# Altium schematic sheet TopPrinter-F0.2.1_PCB.SchDoc
size 635 x 431 mm
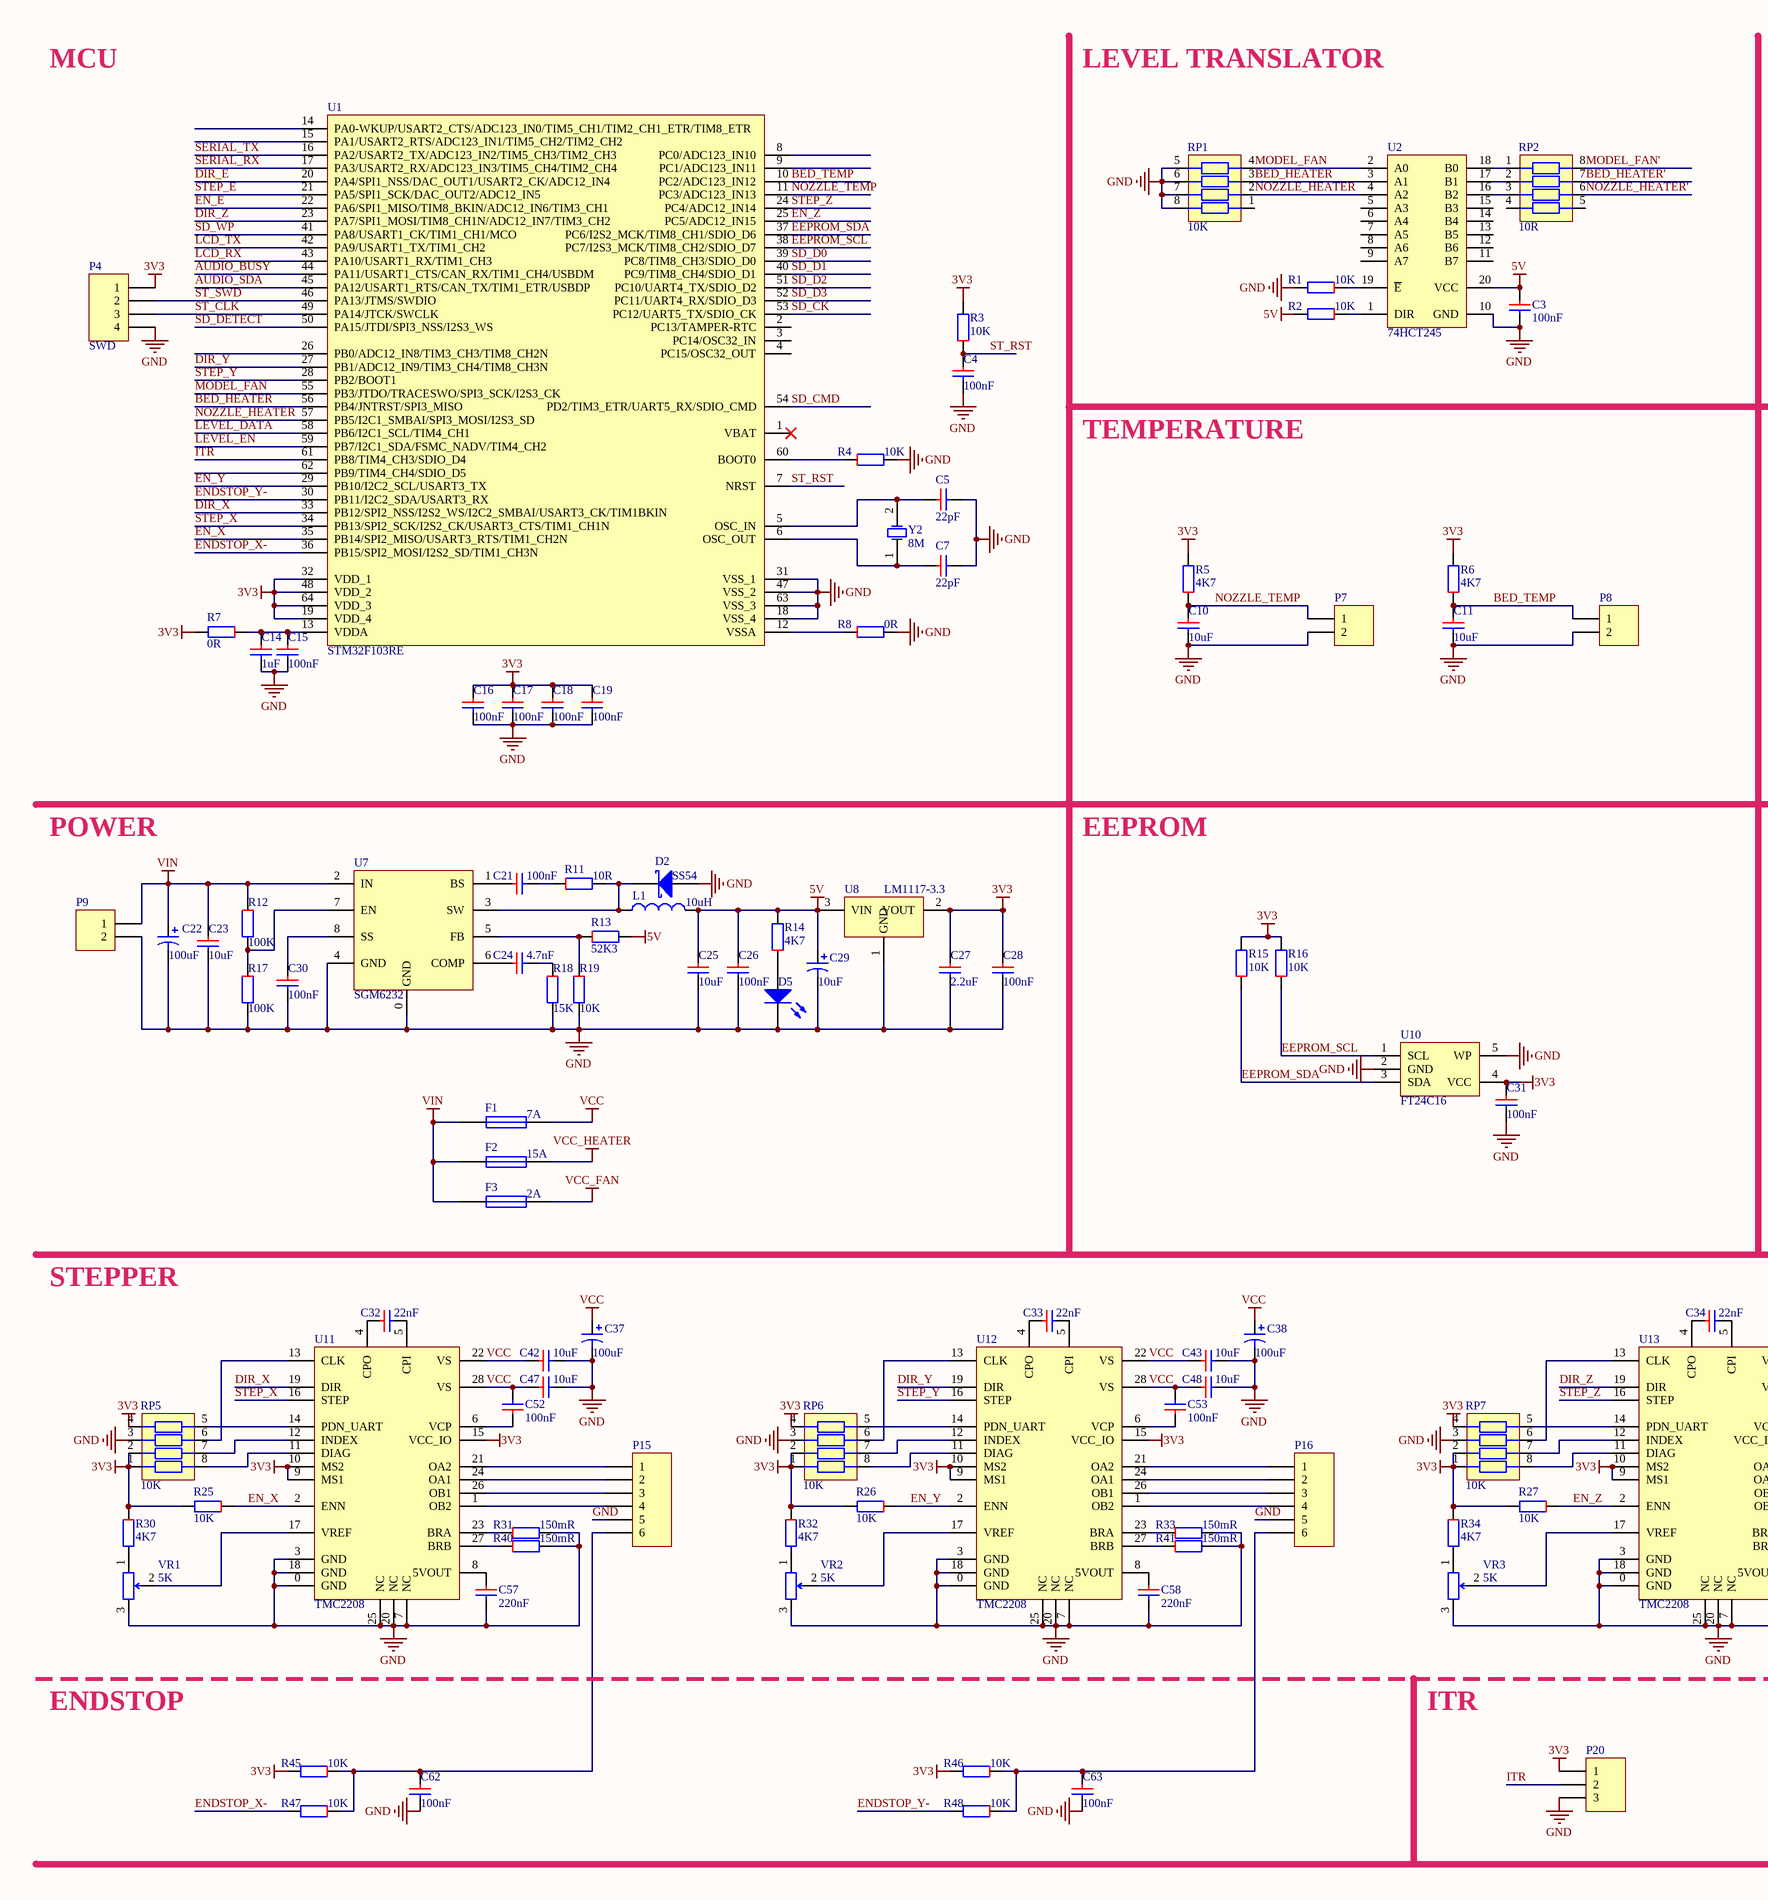
[diagram p0: TopPrinter-F0.2.1_PCB.SchDoc, left]
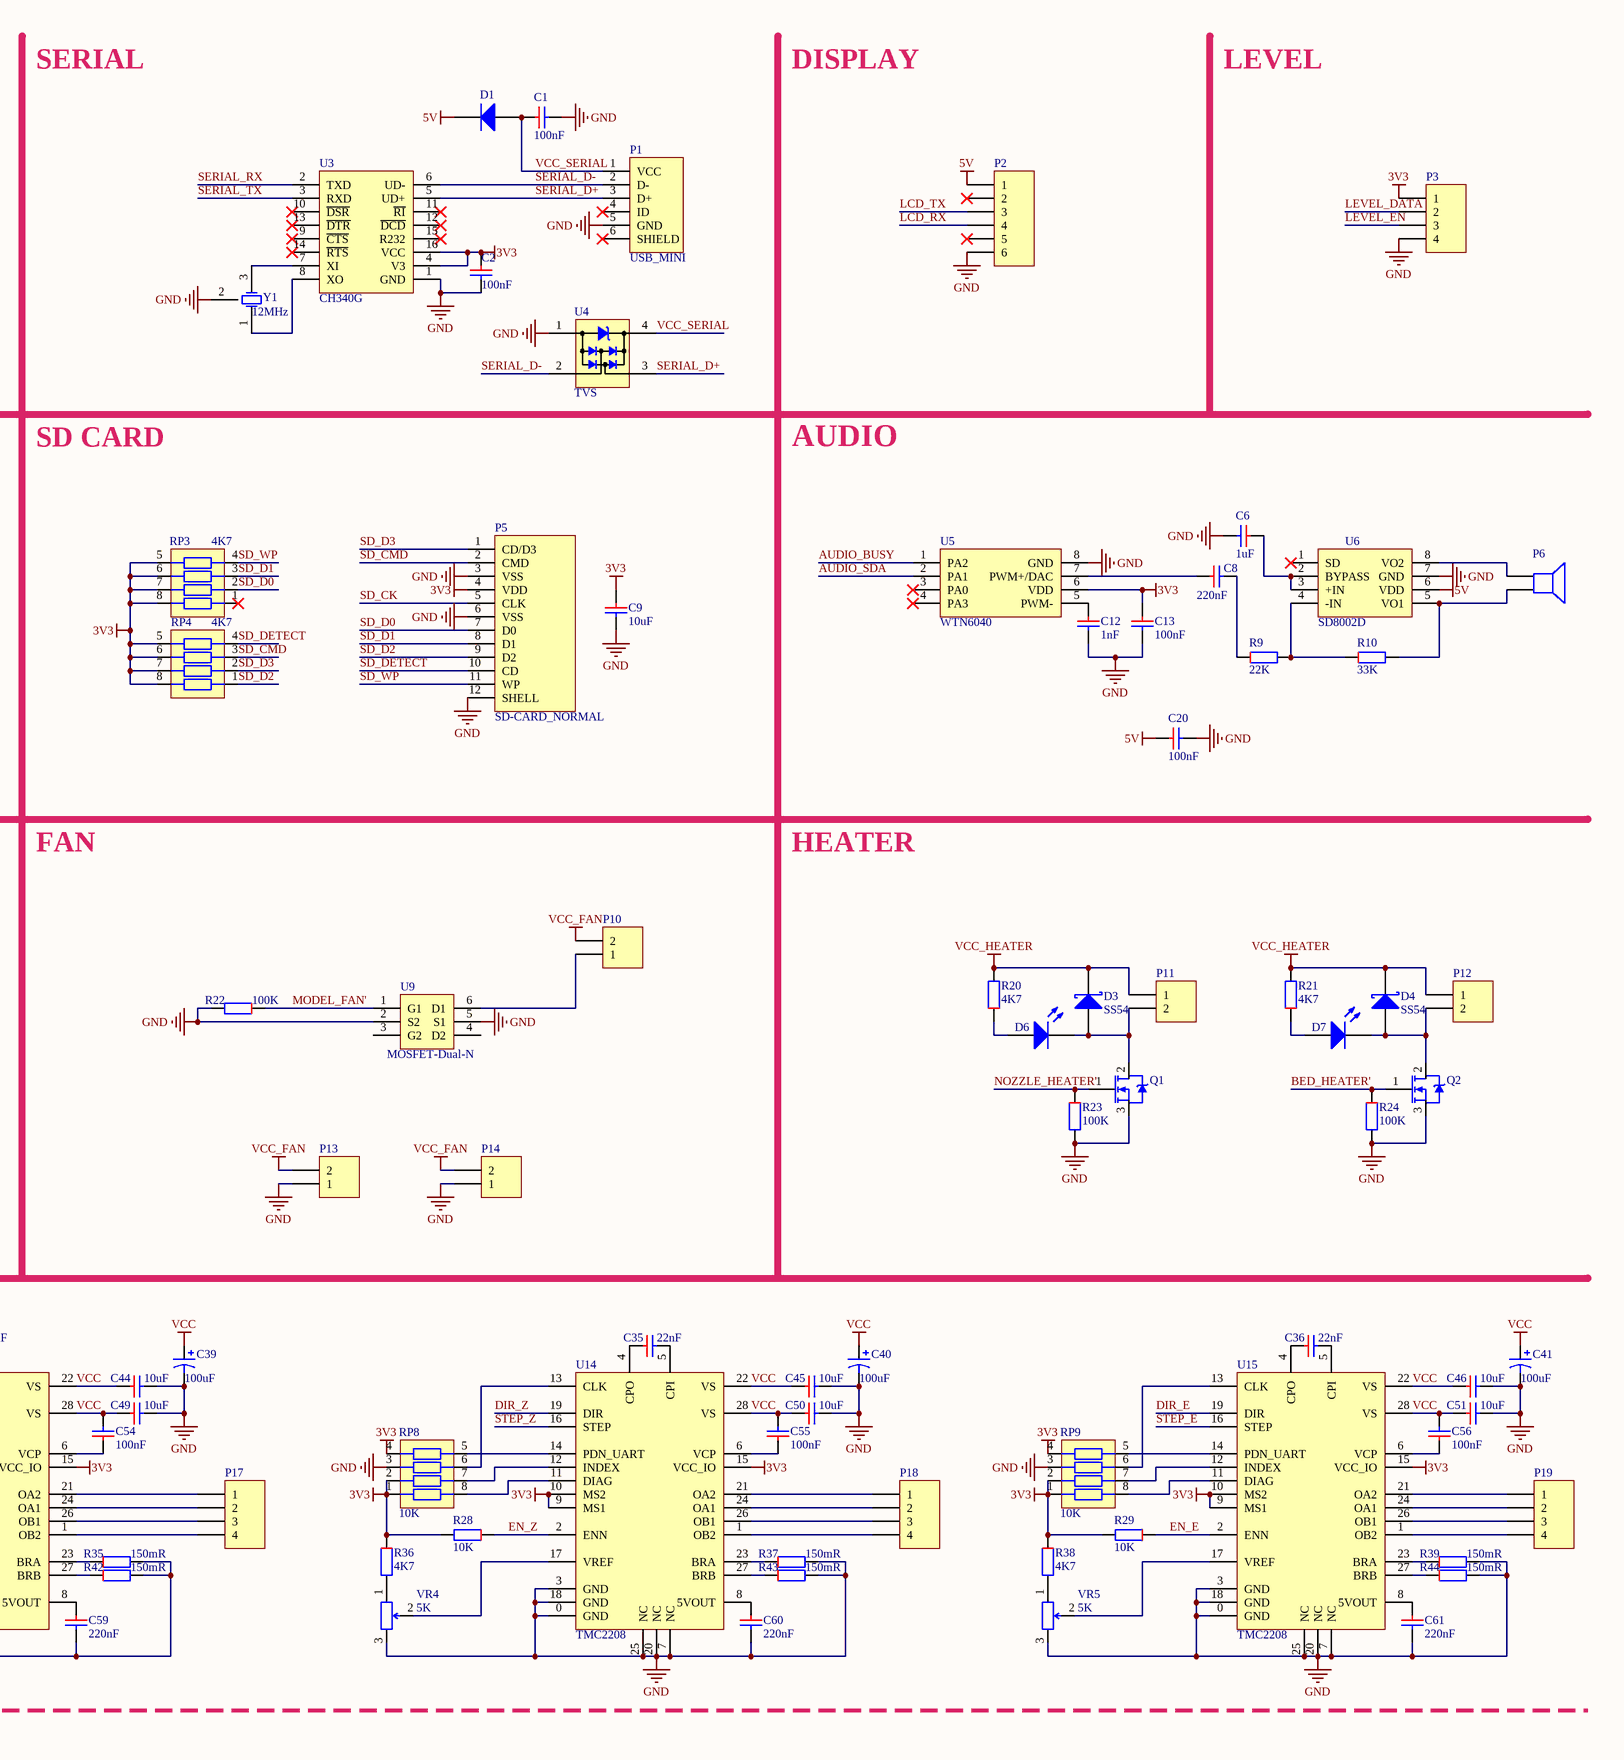
[diagram p1: TopPrinter-F0.2.1_PCB.SchDoc, right]

## Parts
C1  100nF  [C-0603]
C2  100nF  [C-0603]
C3  100nF  [C-0603]
C4  100nF  [C-0603]
C5  22pF  [C-0603]
C6  1uF  [C-0603]
C7  22pF  [C-0603]
C8  220nF  [C-0603]
C9  10uF  [C-0603]
C10  10uF  [C-0603]
C11  10uF  [C-0603]
C12  1nF  [C-0603]
C13  100nF  [C-0603]
C14  1uF  [C-0603]
C15  100nF  [C-0603]
C16  100nF  [C-0603]
C17  100nF  [C-0603]
C18  100nF  [C-0603]
C19  100nF  [C-0603]
C20  100nF  [C-0603]
C21  100nF  [C-0603]
C22  100uF  [CAP-6.3x7.7]
C23  10uF  [C-0805]
C24  4.7nF  [C-0603]
C25  10uF  [C-0805]
C26  100nF  [C-0603]
C27  2.2uF  [C-0603]
C28  100nF  [C-0603]
C29  10uF  [TAN-A]
C30  100nF  [C-0603]
C31  100nF  [C-0603]
C32  22nF  [C-0603]
C33  22nF  [C-0603]
C34  22nF  [C-0603]
C35  22nF  [C-0603]
C36  22nF  [C-0603]
C37  100uF  [CAP-6.3x7.7]
C38  100uF  [CAP-6.3x7.7]
C39  100uF  [CAP-6.3x7.7]
C40  100uF  [CAP-6.3x7.7]
C41  100uF  [CAP-6.3x7.7]
C42  10uF  [C-0805]
C43  10uF  [C-0805]
C44  10uF  [C-0805]
C45  10uF  [C-0805]
C46  10uF  [C-0805]
C47  10uF  [C-0805]
C48  10uF  [C-0805]
C49  10uF  [C-0805]
C50  10uF  [C-0805]
C51  10uF  [C-0805]
C52  100nF  [C-0603]
C53  100nF  [C-0603]
C54  100nF  [C-0603]
C55  100nF  [C-0603]
C56  100nF  [C-0603]
C57  220nF  [C-0603]
C58  220nF  [C-0603]
C59  220nF  [C-0603]
C60  220nF  [C-0603]
C61  220nF  [C-0603]
C62  100nF  [C-0603]
C63  100nF  [C-0603]
D1  MBR0520  [SOD-123]  (value not drawn)
D2  SS54  [DO-214AC]
D3  SS54  [DO-214AC]
D4  SS54  [DO-214AC]
D5  GRE  [LED-0603]  (value not drawn)
D6  BLU  [LED-0603]  (value not drawn)
D7  BLU  [LED-0603]  (value not drawn)
F1  7A  [F-1206]
F2  15A  [F-1206]
F3  2A  [F-1206]
L1  10uH  [L-6045]
P1  USB_MINI  [USB-MINI-5P-SMD]
P2  (no value)  [XH-6A]
P3  (no value)  [XH-4A]
P4  SWD  [HDR1X4]
P5  SD-CARD_NORMAL  [SD-NORMAL-9P-PUSH]
P6  (no value)  [XH-2A]
P7  (no value)  [XH-2A]
P8  (no value)  [XH-2A]
P9  (no value)  [CON-5.0-2P]
P10  (no value)  [XH-2A]
P11  (no value)  [CON-5.0-2P]
P12  (no value)  [CON-5.0-2P]
P13  (no value)  [XH-2A]
P14  (no value)  [XH-2A]
P15  (no value)  [XH-6A]
P16  (no value)  [XH-6A]
P17  (no value)  [XH-4A]
P18  (no value)  [XH-4A]
P19  (no value)  [XH-4A]
P20  Header 3  [XH-3A]  (value not drawn)
Q1  HY3403D  [TO-252-2]  (value not drawn)
Q2  HY3403D  [TO-252-2]  (value not drawn)
R1  10K  [R-0603]
R2  10K  [R-0603]
R3  10K  [R-0603]
R4  10K  [R-0603]
R5  4K7  [R-0603]
R6  4K7  [R-0603]
R7  0R  [R-0603]
R8  0R  [R-0603]
R9  22K  [R-0603]
R10  33K  [R-0603]
R11  10R  [R-0603]
R12  100K  [R-0603]
R13  52K3  [R-0603]
R14  4K7  [R-0603]
R15  10K  [R-0603]
R16  10K  [R-0603]
R17  100K  [R-0603]
R18  15K  [R-0603]
R19  10K  [R-0603]
R20  4K7  [R-0603]
R21  4K7  [R-0603]
R22  100K  [R-0603]
R23  100K  [R-0603]
R24  100K  [R-0603]
R25  10K  [R-0603]
R26  10K  [R-0603]
R27  10K  [R-0603]
R28  10K  [R-0603]
R29  10K  [R-0603]
R30  4K7  [R-0603]
R31  150mR  [R-1206]
R32  4K7  [R-0603]
R33  150mR  [R-1206]
R34  4K7  [R-0603]
R35  150mR  [R-1206]
R36  4K7  [R-0603]
R37  150mR  [R-1206]
R38  4K7  [R-0603]
R39  150mR  [R-1206]
R40  150mR  [R-1206]
R41  150mR  [R-1206]
R42  150mR  [R-1206]
R43  150mR  [R-1206]
R44  150mR  [R-1206]
R45  10K  [R-0603]
R46  10K  [R-0603]
R47  10K  [R-0603]
R48  10K  [R-0603]
RP1  10K  [R-0603x4]
RP2  10R  [R-0603x4]
RP3  4K7  [R-0603x4]
RP4  4K7  [R-0603x4]
RP5  10K  [R-0603x4]
RP6  10K  [R-0603x4]
RP7  10K  [R-0603x4]
RP8  10K  [R-0603x4]
RP9  10K  [R-0603x4]
U1  STM32F103RE  [LQFP-64]
U2  74HCT245  [TSSOP-20]
U3  CH340G  [SOIC-16-150MIL]
U4  TVS  [SOT-143]
U5  WTN6040  [SOIC-8-150MIL]
U6  SD8002D  [SOIC-8-150MIL]
U7  SGM6232  [SOIC-8-150MIL-PAD]
U8  LM1117-3.3  [SOT-223]
U9  MOSFET-Dual-N  [SOT-23-6]
U10  FT24C16  [SOT-23-5]
U11  TMC2208  [QFN-28-5x5x05]
U12  TMC2208  [QFN-28-5x5x05]
U13  TMC2208  [QFN-28-5x5x05]
U14  TMC2208  [QFN-28-5x5x05]
U15  TMC2208  [QFN-28-5x5x05]
VR1  5K  [RP-3MM-SMD]
VR2  5K  [RP-3MM-SMD]
VR3  5K  [RP-3MM-SMD]
VR4  5K  [RP-3MM-SMD]
VR5  5K  [RP-3MM-SMD]
Y1  12MHz  [XTAL-3215-3P]
Y2  8M  [XTAL-5032-2P]

## Nets
3V3: C2.1 C9.1 C13.1 C16.1 C17.1 C18.1 C19.1 C27.1 C28.1 C31.1 P3.1 P4.1 P5.4(VDD) P20.1 R3.2 R5.2 R6.2 R7.2 R15.2 R16.2 R25.2 R26.2 R27.2 R28.2 R29.2 R30.1 R32.1 R34.1 R36.1 R38.1 R45.2 R46.2 RP3.5 RP3.6 RP3.7 RP3.8 RP4.5 RP4.6 RP4.7 RP4.8 RP5.1 RP5.2 RP5.4 RP6.1 RP6.2 RP6.4 RP7.1 RP7.2 RP7.4 RP8.1 RP8.2 RP8.4 RP9.1 RP9.2 RP9.4 U1.19(VDD_4) U1.32(VDD_1) U1.48(VDD_2) U1.64(VDD_3) U3.4(V3) U3.16(VCC) U5.6(VDD) U8.2(VOUT) U10.4(VCC) U11.9(MS1) U11.10(MS2) U11.15(VCC_IO) U12.9(MS1) U12.10(MS2) U12.15(VCC_IO) U13.9(MS1) U13.10(MS2) U13.15(VCC_IO) U14.9(MS1) U14.10(MS2) U14.15(VCC_IO) U15.9(MS1) U15.10(MS2) U15.15(VCC_IO)
5V: C3.1 C20.1 C25.1 C26.1 C29.1 D1.2(K) L1.2 P2.1 R2.2 R13.2 R14.2 U2.20(VCC) U6.6(VDD) U8.3(VIN)
GND: C1.2 C2.2 C3.2 C4.2 C5.2 C6.2 C7.2 C9.2 C10.2 C11.2 C12.2 C13.2 C14.2 C15.2 C16.2 C17.2 C18.2 C19.2 C20.2 C22.2 C23.2 C25.2 C26.2 C27.2 C28.2 C29.2 C30.2 C31.2 C37.2 C38.2 C39.2 C40.2 C41.2 C42.2 C43.2 C44.2 C45.2 C46.2 C47.2 C48.2 C49.2 C50.2 C51.2 C57.2 C58.2 C59.2 C60.2 C61.2 C62.2 C63.2 D2.1(A) D5.2(K) P1.5(GND) P2.6 P3.4 P4.4 P5.3(VSS) P5.6(VSS) P5.12(SHELL) P7.2 P8.2 P9.2 P13.1 P14.1 P15.5 P16.5 P20.3 Q1.3(S) Q2.3(S) R1.2 R4.2 R8.2 R17.2 R18.2 R19.2 R22.2 R23.2 R24.2 R31.2 R33.2 R35.2 R37.2 R39.2 R40.2 R41.2 R42.2 R43.2 R44.2 RP1.5 RP1.6 RP1.7 RP1.8 RP5.3 RP6.3 RP7.3 RP8.3 RP9.3 U1.18(VSS_4) U1.31(VSS_1) U1.47(VSS_2) U1.63(VSS_3) U2.10(GND) U3.1(GND) U4.1(GND) U5.8(GND) U6.7(GND) U7.0(GND) U7.4(GND) U8.1(GND) U9.2(S2) U9.5(S1) U10.2(GND) U10.5(WP) U11.0(GND) U11.3(GND) U11.7(NC) U11.18(GND) U11.20(NC) U11.25(NC) U12.0(GND) U12.3(GND) U12.7(NC) U12.18(GND) U12.20(NC) U12.25(NC) U13.0(GND) U13.3(GND) U13.7(NC) U13.18(GND) U13.20(NC) U13.25(NC) U14.0(GND) U14.3(GND) U14.7(NC) U14.18(GND) U14.20(NC) U14.25(NC) U15.0(GND) U15.3(GND) U15.7(NC) U15.18(GND) U15.20(NC) U15.25(NC) VR1.3 VR2.3 VR3.3 VR4.3 VR5.3 Y1.2
VCC: C37.1 C38.1 C39.1 C40.1 C41.1 C42.1 C43.1 C44.1 C45.1 C46.1 C47.1 C48.1 C49.1 C50.1 C51.1 C52.2 C53.2 C54.2 C55.2 C56.2 F1.2 U11.22(VS) U11.28(VS) U12.22(VS) U12.28(VS) U13.22(VS) U13.28(VS) U14.22(VS) U14.28(VS) U15.22(VS) U15.28(VS)
VCC_FAN: F3.2 P10.2 P13.2 P14.2
VCC_HEATER: D3.2(K) D4.2(K) F2.2 P11.1 P12.1 R20.2 R21.2
VIN: C22.1 C23.1 F1.1 F2.1 F3.1 P9.1 R12.1 U7.2(IN)
AUDIO_BUSY: U1.44(PA11/USART1_CTS/CAN_RX/TIM1_CH4/USBDM) U5.1(PA2)
AUDIO_SDA: U1.45(PA12/USART1_RTS/CAN_TX/TIM1_ETR/USBDP) U5.2(PA1)
BED_HEATER: RP1.3 U1.56(PB4/JNTRST/SPI3_MISO) U2.3(A1)
BED_HEATER': Q2.1(G) R24.1 RP2.7
BED_TEMP: C11.1 P8.1 R6.1 U1.10(PC2/ADC123_IN12)
DIR_E: U1.20(PA4/SPI1_NSS/DAC_OUT1/USART2_CK/ADC12_IN4) U15.19(DIR)
DIR_X: U1.33(PB12/SPI2_NSS/I2S2_WS/I2C2_SMBAI/USART3_CK/TIM1BKIN) U11.19(DIR)
DIR_Y: U1.27(PB1/ADC12_IN9/TIM3_CH4/TIM8_CH3N) U12.19(DIR)
DIR_Z: U1.23(PA7/SPI1_MOSI/TIM8_CH1N/ADC12_IN7/TIM3_CH2) U13.19(DIR) U14.19(DIR)
EEPROM_SCL: R16.1 U1.38(PC7/I2S3_MCK/TIM8_CH2/SDIO_D7) U10.1(SCL)
EEPROM_SDA: R15.1 U1.37(PC6/I2S2_MCK/TIM8_CH1/SDIO_D6) U10.3(SDA)
EN_E: R29.1 U1.22(PA6/SPI1_MISO/TIM8_BKIN/ADC12_IN6/TIM3_CH1) U15.2(ENN)
EN_X: R25.1 U1.35(PB14/SPI2_MISO/USART3_RTS/TIM1_CH2N) U11.2(ENN)
EN_Y: R26.1 U1.29(PB10/I2C2_SCL/USART3_TX) U12.2(ENN)
EN_Z: R27.1 R28.1 U1.25(PC5/ADC12_IN15) U13.2(ENN) U14.2(ENN)
ENDSTOP_X-: R47.2 U1.36(PB15/SPI2_MOSI/I2S2_SD/TIM1_CH3N)
ENDSTOP_Y-: R48.2 U1.30(PB11/I2C2_SDA/USART3_RX)
ITR: P20.2 U1.61(PB8/TIM4_CH3/SDIO_D4)
LCD_RX: P2.4 U1.43(PA10/USART1_RX/TIM1_CH3)
LCD_TX: P2.3 U1.42(PA9/USART1_TX/TIM1_CH2)
LEVEL_DATA: P3.2 U1.58(PB6/I2C1_SCL/TIM4_CH1)
LEVEL_EN: P3.3 U1.59(PB7/I2C1_SDA/FSMC_NADV/TIM4_CH2)
MODEL_FAN: RP1.4 U1.55(PB3/JTDO/TRACESWO/SPI3_SCK/I2S3_CK) U2.2(A0)
MODEL_FAN': R22.1 RP2.8 U9.1(G1)
NOZZLE_HEATER: RP1.2 U1.57(PB5/I2C1_SMBAI/SPI3_MOSI/I2S3_SD) U2.4(A2)
NOZZLE_HEATER': Q1.1(G) R23.1 RP2.6
NOZZLE_TEMP: C10.1 P7.1 R5.1 U1.11(PC3/ADC123_IN13)
SD_CK: P5.5(CLK) U1.53(PC12/UART5_TX/SDIO_CK)
SD_CMD: P5.2(CMD) RP4.3 U1.54(PD2/TIM3_ETR/UART5_RX/SDIO_CMD)
SD_D0: P5.7(D0) RP3.2 U1.39(PC8/TIM8_CH3/SDIO_D0)
SD_D1: P5.8(D1) RP3.3 U1.40(PC9/TIM8_CH4/SDIO_D1)
SD_D2: P5.9(D2) RP4.1 U1.51(PC10/UART4_TX/SDIO_D2)
SD_D3: P5.1(CD/D3) RP4.2 U1.52(PC11/UART4_RX/SDIO_D3)
SD_DETECT: P5.10(CD) RP4.4 U1.50(PA15/JTDI/SPI3_NSS/I2S3_WS)
SD_WP: P5.11(WP) RP3.4 U1.41(PA8/USART1_CK/TIM1_CH1/MCO)
SERIAL_D+: P1.3(D+) U3.5(UD+) U4.3(IN)
SERIAL_D-: P1.2(D-) U3.6(UD-) U4.2(IN)
SERIAL_RX: U1.17(PA3/USART2_RX/ADC123_IN3/TIM5_CH4/TIM2_CH4) U3.2(TXD)
SERIAL_TX: U1.16(PA2/USART2_TX/ADC123_IN2/TIM5_CH3/TIM2_CH3) U3.3(RXD)
ST_CLK: P4.3 U1.49(PA14/JTCK/SWCLK)
ST_RST: C4.1 R3.1 U1.7(NRST)
ST_SWD: P4.2 U1.46(PA13/JTMS/SWDIO)
STEP_E: U1.21(PA5/SPI1_SCK/DAC_OUT2/ADC12_IN5) U15.16(STEP)
STEP_X: U1.34(PB13/SPI2_SCK/I2S2_CK/USART3_CTS/TIM1_CH1N) U11.16(STEP)
STEP_Y: U1.28(PB2/BOOT1) U12.16(STEP)
STEP_Z: U1.24(PC4/ADC12_IN14) U13.16(STEP) U14.16(STEP)
VCC_SERIAL: C1.1 D1.1(A) P1.1(VCC) U4.4(VCC)
NetC5_1: C5.1 U1.5(OSC_IN) Y2.2(OSC2)
NetC6_1: C6.1 U6.2(BYPASS) U6.3(+IN)
NetC7_1: C7.1 U1.6(OSC_OUT) Y2.1(OSC1)
NetC8_1: C8.1 U5.7(PWM+/DAC)
NetC8_2: C8.2 R9.1
NetC12_1: C12.1 U5.5(PWM-)
NetC14_1: C14.1 C15.1 R7.1 U1.13(VDDA)
NetC21_1: C21.1 U7.1(BS)
NetC21_2: C21.2 R11.1
NetC24_1: C24.1 U7.6(COMP)
NetC24_2: C24.2 R18.1
NetC30_1: C30.1 U7.8(SS)
NetC32_1: C32.1 U11.4(CPO)
NetC32_2: C32.2 U11.5(CPI)
NetC33_1: C33.1 U12.4(CPO)
NetC33_2: C33.2 U12.5(CPI)
NetC34_1: C34.1 U13.4(CPO)
NetC34_2: C34.2 U13.5(CPI)
NetC35_1: C35.1 U14.4(CPO)
NetC35_2: C35.2 U14.5(CPI)
NetC36_1: C36.1 U15.4(CPO)
NetC36_2: C36.2 U15.5(CPI)
NetC52_1: C52.1 U11.6(VCP)
NetC53_1: C53.1 U12.6(VCP)
NetC54_1: C54.1 U13.6(VCP)
NetC55_1: C55.1 U14.6(VCP)
NetC56_1: C56.1 U15.6(VCP)
NetC57_1: C57.1 U11.8(5VOUT)
NetC58_1: C58.1 U12.8(5VOUT)
NetC59_1: C59.1 U13.8(5VOUT)
NetC60_1: C60.1 U14.8(5VOUT)
NetC61_1: C61.1 U15.8(5VOUT)
NetC62_1: C62.1 P15.6 R45.1 R47.1
NetC63_1: C63.1 P16.6 R46.1 R48.1
NetD2_2: D2.2(K) L1.1 R11.2 U7.3(SW)
NetD3_1: D3.1(A) D6.2(K) P11.2 Q1.2(D)
NetD4_1: D4.1(A) D7.2(K) P12.2 Q2.2(D)
NetD5_1: D5.1(A) R14.1
NetD6_1: D6.1(A) R20.1
NetD7_1: D7.1(A) R21.1
NetP6_1: P6.1 R10.2 U6.5(VO1)
NetP6_2: P6.2 U6.8(VO2)
NetP10_1: P10.1 U9.6(D1)
NetP15_1: P15.1 U11.21(OA2)
NetP15_2: P15.2 U11.24(OA1)
NetP15_3: P15.3 U11.26(OB1)
NetP15_4: P15.4 U11.1(OB2)
NetP16_1: P16.1 U12.21(OA2)
NetP16_2: P16.2 U12.24(OA1)
NetP16_3: P16.3 U12.26(OB1)
NetP16_4: P16.4 U12.1(OB2)
NetP17_1: P17.1 U13.21(OA2)
NetP17_2: P17.2 U13.24(OA1)
NetP17_3: P17.3 U13.26(OB1)
NetP17_4: P17.4 U13.1(OB2)
NetP18_1: P18.1 U14.21(OA2)
NetP18_2: P18.2 U14.24(OA1)
NetP18_3: P18.3 U14.26(OB1)
NetP18_4: P18.4 U14.1(OB2)
NetP19_1: P19.1 U15.21(OA2)
NetP19_2: P19.2 U15.24(OA1)
NetP19_3: P19.3 U15.26(OB1)
NetP19_4: P19.4 U15.1(OB2)
NetR1_1: R1.1 U2.19(~{E})
NetR2_1: R2.1 U2.1(DIR)
NetR4_1: R4.1 U1.60(BOOT0)
NetR8_1: R8.1 U1.12(VSSA)
NetR9_2: R9.2 R10.1 U6.4(-IN)
NetR12_2: R12.2 R17.1 U7.7(EN)
NetR13_1: R13.1 R19.1 U7.5(FB)
NetR30_2: R30.2 VR1.1
NetR31_1: R31.1 U11.23(BRA)
NetR32_2: R32.2 VR2.1
NetR33_1: R33.1 U12.23(BRA)
NetR34_2: R34.2 VR3.1
NetR35_1: R35.1 U13.23(BRA)
NetR36_2: R36.2 VR4.1
NetR37_1: R37.1 U14.23(BRA)
NetR38_2: R38.2 VR5.1
NetR39_1: R39.1 U15.23(BRA)
NetR40_1: R40.1 U11.27(BRB)
NetR41_1: R41.1 U12.27(BRB)
NetR42_1: R42.1 U13.27(BRB)
NetR43_1: R43.1 U14.27(BRB)
NetR44_1: R44.1 U15.27(BRB)
NetRP2_1: RP2.1 U2.18(B0)
NetRP2_2: RP2.2 U2.17(B1)
NetRP2_3: RP2.3 U2.16(B2)
NetRP5_5: RP5.5 U11.14(PDN_UART)
NetRP5_6: RP5.6 U11.13(CLK)
NetRP5_7: RP5.7 U11.12(INDEX)
NetRP5_8: RP5.8 U11.11(DIAG)
NetRP6_5: RP6.5 U12.14(PDN_UART)
NetRP6_6: RP6.6 U12.13(CLK)
NetRP6_7: RP6.7 U12.12(INDEX)
NetRP6_8: RP6.8 U12.11(DIAG)
NetRP7_5: RP7.5 U13.14(PDN_UART)
NetRP7_6: RP7.6 U13.13(CLK)
NetRP7_7: RP7.7 U13.12(INDEX)
NetRP7_8: RP7.8 U13.11(DIAG)
NetRP8_5: RP8.5 U14.14(PDN_UART)
NetRP8_6: RP8.6 U14.13(CLK)
NetRP8_7: RP8.7 U14.12(INDEX)
NetRP8_8: RP8.8 U14.11(DIAG)
NetRP9_5: RP9.5 U15.14(PDN_UART)
NetRP9_6: RP9.6 U15.13(CLK)
NetRP9_7: RP9.7 U15.12(INDEX)
NetRP9_8: RP9.8 U15.11(DIAG)
NetU3_7: U3.7(XI) Y1.3(OSC2)
NetU3_8: U3.8(XO) Y1.1(OSC1)
NetU11_17: U11.17(VREF) VR1.2
NetU12_17: U12.17(VREF) VR2.2
NetU13_17: U13.17(VREF) VR3.2
NetU14_17: U14.17(VREF) VR4.2
NetU15_17: U15.17(VREF) VR5.2

Not connected (* = marked no-connect by the designer): P1 4(ID)* 6(SHIELD)*; P2 2* 5*; RP1 1; RP2 4(1) 5(1); RP3 1*; U1 1(VBAT)* 2(PC13/TAMPER-RTC) 3(PC14/OSC32_IN) 4(PC15/OSC32_OUT) 8(PC0/ADC123_IN10) 9(PC1/ADC123_IN11) 14(PA0-WKUP/USART2_CTS/ADC123_IN0/TIM5_CH1/TIM2_CH1_ETR/TIM8_ETR) 15(PA1/USART2_RTS/ADC123_IN1/TIM5_CH2/TIM2_CH2) 26(PB0/ADC12_IN8/TIM3_CH3/TIM8_CH2N) 62(PB9/TIM4_CH4/SDIO_D5); U2 5(A3) 6(A4) 7(A5) 8(A6) 9(A7) 11(B7) 12(B6) 13(B5) 14(B4) 15(B3); U3 9(~{CTS})* 10(~{DSR})* 11(~{RI})* 12(~{DCD})* 13(~{DTR})* 14(~{RTS})* 15(R232)*; U5 3(PA0)* 4(PA3)*; U6 1(SD)*; U9 3(G2) 4(D2)

## Notes on the sheet
- MCU
- LEVEL TRANSLATOR
- SERIAL
- DISPLAY
- LEVEL
- TEMPERATURE
- SD CARD
- AUDIO
- POWER
- EEPROM
- FAN
- HEATER
- STEPPER
- ENDSTOP
- ITR

## Library data of the parts
C1-C21 C23-C28 C30-C36 C42-C63 = Cap: Published: 8-Jun-2000; LatestRevisionDate: 17-Jul-2002; LatestRevisionNote: Re-released for DXP Platform.; PackageReference: RAD-0.3; Publisher: Altium Limited; PackageDescription: Radial Cap, Thru-Hole; 2 Leads; 0.3 in Pin Spacing
  C1-C4 C13 C15-C21 C26 C28 C30 C31 C52-C56 C62 C63: Value: 100nF
  C5 C7: Value: 22pF
  C6 C14: Value: 1uF
  C8 C57-C61: Value: 220nF
  C9-C11 C23 C25 C42-C51: Value: 10uF
  C12: Value: 1nF
  C24: Value: 4.7nF
  C27: Value: 2.2uF
  C32-C36: Value: 22nF
C22 C29 C37-C41 = Cap Pol1: Polarized Capacitor (Radial); Published: 8-Jun-2000; LatestRevisionDate: 17-Jul-2002; LatestRevisionNote: Re-released for DXP Platform.; PackageReference: RB7.6-15; Publisher: Altium Limited; PackageDescription: Polarized Capacitor (Radial); 2 Leads
  C22 C37-C41: Value: 100uF
  C29: Value: 10uF
D1 = Diode: Default Diode; Published: 8-Jun-2000; LatestRevisionDate: 17-Jul-2002; LatestRevisionNote: Re-released for DXP Platform.; PackageVersion: Sep-1996; PackageReference: SMC; Publisher: Altium Limited; PackageDescription: DO-214-AB/SMC; 2 C-Bend Leads; Body 7.9 x 5.9 mm, inc. leads (LxW); Code_JEDEC: DO-214-AB
D2-D4 = D Schottky: Schottky Diode; Published: 8-Jun-2000; LatestRevisionDate: 17-Jul-2002; LatestRevisionNote: Re-released for DXP Platform.; PackageReference: SMB; Publisher: Altium Limited; PackageDescription: DO-214-AA/SMB; 2 C-Bend Leads; Body 5.3 x 3.6 mm, inc. leads (LxW); Code_JEDEC: DO-214-AA
D5-D7 = LED0: Typical INFRARED GaAs LED; Published: 8-Jun-2000; LatestRevisionDate: 08-Jul-2005; LatestRevisionNote: Mech Layer 1 removed.; PackageReference: LED-0; Publisher: Altium Limited; PackageDescription: LED; 2 Leads
F1-F3 = Fuse 1: Fuse; Published: 8-Jun-2000; LatestRevisionDate: 17-Jul-2002; LatestRevisionNote: Re-released for DXP Platform.; PackageReference: PIN-W2/E2.8; Publisher: Altium Limited; PackageDescription: Thru-Hole; 2 Leads
L1 = Inductor: Code_IEC: 1005; Published: 8-Jun-2000; LatestRevisionDate: 29-May-2009; LatestRevisionNote: IPC-7351 Footprint Added.; PackageReference: 0402-A; Publisher: Altium Limited; PackageDescription: Chip Inductor; Code_JEITA: 0402; Value: 10uH
P2 P15 P16 = Header 6: Header, 6-Pin; LatestRevisionDate: 17-Jul-2002; LatestRevisionNote: Re-released for DXP Platform.; Publisher: Altium Limited
P3 P4 P17-P19 = Header 4: Header, 4-Pin; LatestRevisionDate: 17-Jul-2002; LatestRevisionNote: Re-released for DXP Platform.; Publisher: Altium Limited
P6 = Speaker: Loudspeaker; Published: 24-Mar-1999; LatestRevisionDate: 17-Jul-2002; LatestRevisionNote: Re-released for DXP Platform.; PackageReference: PIN2; Publisher: Altium Limited
P7-P14 = Header 2: Header, 2-Pin; LatestRevisionDate: 17-Jul-2002; LatestRevisionNote: Re-released for DXP Platform.; Publisher: Altium Limited
P20 = Header 3: Header, 3-Pin; LatestRevisionDate: 17-Jul-2002; LatestRevisionNote: Re-released for DXP Platform.; Publisher: Altium Limited
Q1 Q2 = MOSFET-N
R1-R48 = Res: Published: 8-Jun-2000; LatestRevisionDate: 17-Jul-2002; LatestRevisionNote: Re-released for DXP Platform.; PackageReference: AXIAL-0.4; Publisher: Altium Limited; PackageDescription: Axial Device, Thru-Hole; 2 Leads; 0.4 in Pin Spacing
  R1-R4 R15 R16 R19 R25-R29 R45-R48: Value: 10K
  R5 R6 R14 R20 R21 R30 R32 R34 R36 R38: Value: 4K7
  R7 R8: Value: 0R
  R9: Value: 22K
  R10: Value: 33K
  R11: Value: 10R
  R12 R17 R22-R24: Value: 100K
  R13: Value: 52K3
  R18: Value: 15K
  R31 R33 R35 R37 R39-R44: Value: 150mR
RP1-RP9 = RES-PACK: Published: 8-Jun-2000; LatestRevisionDate: 17-Jul-2002; LatestRevisionNote: Re-released for DXP Platform.; PackageReference: AXIAL-0.4; Publisher: Altium Limited
  RP1 RP5-RP9: Value: 10K
  RP2: Value: 10R
  RP3 RP4: Value: 4K7
U1 = STM32F103RC
U8 = LM1117
VR1-VR5 = RES-TAP: Published: 8-Jun-2000; LatestRevisionDate: 17-Jul-2002; LatestRevisionNote: Re-released for DXP Platform.; PackageReference: AXIAL-0.4; Publisher: Altium Limited; Value: 5K
Y1 Y2 = XTAL: Crystal Oscillator; Published: 8-Jun-2000; LatestRevisionDate: 17-Jul-2002; LatestRevisionNote: Re-released for DXP Platform.; PackageReference: R38; Publisher: Altium Limited; PackageDescription: Crystal, Thru-Hole; 2 Leads; Body 3.1 x 8.2 mm (Dia.xH)